# Altium project ArtixDuo.PrjPcb (part 8 of 8)
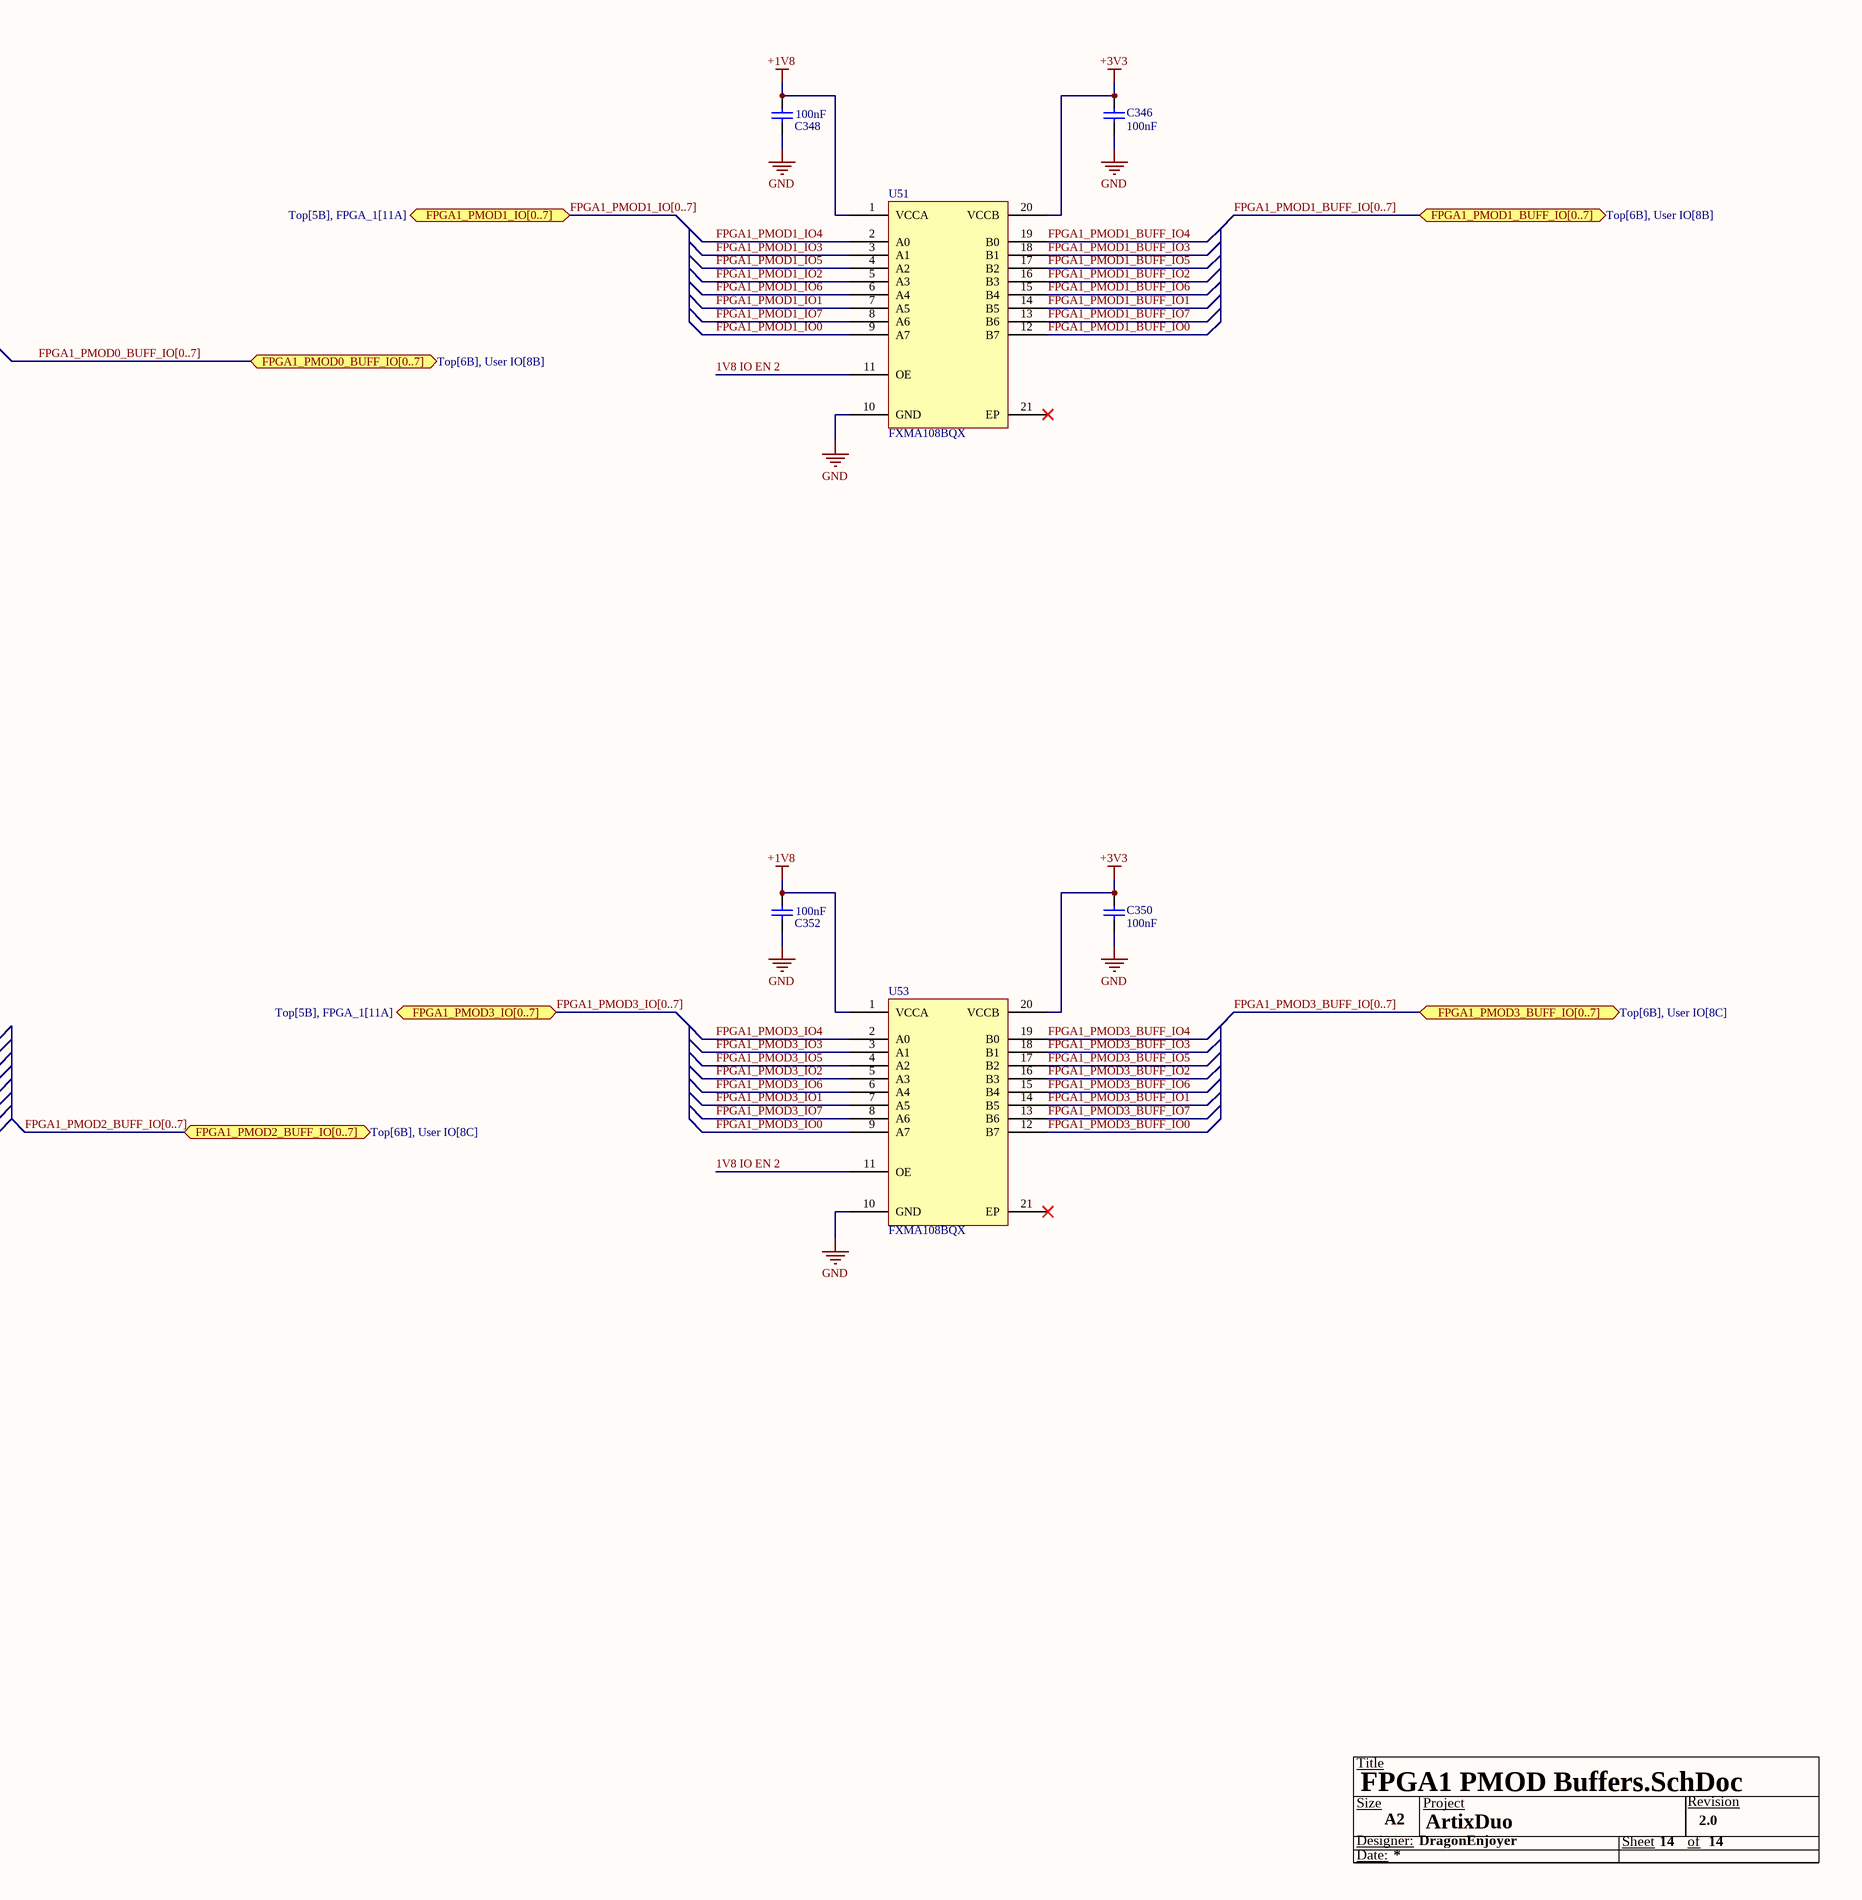
[diagram p38: FPGA1 PMOD Buffers.SchDoc, right]

## Nets that join several sheets
+1V0: FPGA_0 (51 pins), FPGA_1 (51 pins), PMU (U5.1 U5.2 U5.3 U5.12)
+1V2: FPGA_0 (16 pins), FPGA_1 (16 pins), PMU (U4.14 U4.15 U4.16)
+1V8: FPGA_0 (27 pins), FPGA_1 (27 pins), PMU (U3.1 U3.2 U3.3 U3.12), User IO Buffers (9 pins), HYPERRAM (7 pins), FPGA1 PMOD Buffers (9 pins)
+3V3: FPGA_0 (89 pins), FPGA_1 (89 pins), PMU (U1.14 U1.15 U1.16), User IO (55 pins), High Speed User IO (16 pins), User IO Buffers (57 pins), FPGA1 PMOD Buffers (8 pins)
+3V3_AUX: Aux PSU (7 pins), PMU (13 pins), RP2040 MCU (20 pins), SMC (22 pins), USB JTAG (38 pins)
GND: Aux PSU (7 pins), FPGA_0 (198 pins), FPGA_1 (198 pins), PMU (48 pins), RP2040 MCU (31 pins), SMC (35 pins), USB JTAG (76 pins), User IO (198 pins), High Speed User IO (40 pins), User IO Buffers (54 pins), HYPERRAM (7 pins), FPGA1 PMOD Buffers (15 pins)
USB_5V0_AUX_IN: Aux PSU (5 pins), PMU (19 pins), RP2040 MCU (D6.3 TP121.1), SMC (D1.3 TP12.1), USB JTAG (D4.3 TP119.1), User IO (15 pins), User IO Buffers (R275.2 R276.2 R277.1 R278.1), FPGA1 PMOD Buffers (R110.2 R111.1)
DP_RX_AUX_N: FPGA_1 (U9.P1), High Speed User IO (C303.1 U33.2)
DP_RX_AUX_P: FPGA_1 (U9.R1), High Speed User IO (C300.1 U33.1)
DP_RX_HPD: FPGA_1 (U9.J6), High Speed User IO (R267.2 U33.4)
DP_RX_L0_FPGA1_N: FPGA_1 (U9.A8), High Speed User IO (J27.12 U32.12)
DP_RX_L0_FPGA1_P: FPGA_1 (U9.B8), High Speed User IO (J27.10 U32.10)
DP_RX_L1_FPGA1_N: FPGA_1 (U9.C11), High Speed User IO (J27.9 U32.9)
DP_RX_L1_FPGA1_P: FPGA_1 (U9.D11), High Speed User IO (J27.7 U32.7)
DP_RX_L2_FPGA1_N: FPGA_1 (U9.A10), High Speed User IO (J27.6 U32.6)
DP_RX_L2_FPGA1_P: FPGA_1 (U9.B10), High Speed User IO (J27.4 U32.4)
DP_RX_L3_FPGA1_N: FPGA_1 (U9.C9), High Speed User IO (J27.3 U32.3)
DP_RX_L3_FPGA1_P: FPGA_1 (U9.D9), High Speed User IO (J27.1 U32.1)
DP_TX_AUX_N: FPGA_1 (U9.L4), High Speed User IO (C297.1 U31.2)
DP_TX_AUX_P: FPGA_1 (U9.L5), High Speed User IO (C296.1 U31.1)
DP_TX_HPD: FPGA_1 (U9.K6), High Speed User IO (R241.2 U31.4)
DP_TX_L0_FPGA1_N: FPGA_1 (U9.A4), High Speed User IO (C289.1 U30.3)
DP_TX_L0_FPGA1_P: FPGA_1 (U9.B4), High Speed User IO (C288.1 U30.1)
DP_TX_L1_FPGA1_N: FPGA_1 (U9.C5), High Speed User IO (C291.1 U30.6)
DP_TX_L1_FPGA1_P: FPGA_1 (U9.D5), High Speed User IO (C290.1 U30.4)
DP_TX_L2_FPGA1_N: FPGA_1 (U9.A6), High Speed User IO (C293.1 U30.9)
DP_TX_L2_FPGA1_P: FPGA_1 (U9.B6), High Speed User IO (C292.1 U30.7)
DP_TX_L3_FPGA1_N: FPGA_1 (U9.C7), High Speed User IO (C295.1 U30.12)
DP_TX_L3_FPGA1_P: FPGA_1 (U9.D7), High Speed User IO (C294.1 U30.10)
FPGA0_CLK_N: FPGA_0 (U14.E10), High Speed User IO (R264.1 R266.1)
FPGA0_CLK_P: FPGA_0 (U14.F10), High Speed User IO (R263.1 R264.2)
FPGA0_LED0: FPGA_0 (U14.N13), User IO (Q9.1 R205.1)
FPGA0_LED1: FPGA_0 (U14.N14), User IO (Q10.1 R206.1)
FPGA0_LED2: FPGA_0 (U14.P14), User IO (Q11.1 R207.1)
FPGA0_LED3: FPGA_0 (U14.N15), User IO (Q12.1 R208.1)
FPGA0_LED4: FPGA_0 (U14.R16), User IO (Q17.1 R221.1)
FPGA0_LED5: FPGA_0 (U14.P17), User IO (Q18.1 R222.1)
FPGA0_LED6: FPGA_0 (U14.P15), User IO (Q19.1 R223.1)
FPGA0_LED7: FPGA_0 (U14.P16), User IO (Q20.1 R224.1)
FPGA0_PMOD0_IO0: User IO (J6.5), User IO Buffers (U46.13)
FPGA0_PMOD0_IO1: User IO (J6.7), User IO Buffers (U46.15)
FPGA0_PMOD0_IO2: User IO (J6.9), User IO Buffers (U46.17)
FPGA0_PMOD0_IO3: User IO (J6.11), User IO Buffers (U46.19)
FPGA0_PMOD0_IO4: User IO (J6.12), User IO Buffers (U46.18)
FPGA0_PMOD0_IO5: User IO (J6.10), User IO Buffers (U46.16)
FPGA0_PMOD0_IO6: User IO (J6.8), User IO Buffers (U46.14)
FPGA0_PMOD0_IO7: User IO (J6.6), User IO Buffers (U46.12)
FPGA0_PMOD1_IO0: User IO (J10.5), User IO Buffers (U47.13)
FPGA0_PMOD1_IO1: User IO (J10.7), User IO Buffers (U47.15)
FPGA0_PMOD1_IO2: User IO (J10.9), User IO Buffers (U47.17)
FPGA0_PMOD1_IO3: User IO (J10.11), User IO Buffers (U47.19)
FPGA0_PMOD1_IO4: User IO (J10.12), User IO Buffers (U47.18)
FPGA0_PMOD1_IO5: User IO (J10.10), User IO Buffers (U47.16)
FPGA0_PMOD1_IO6: User IO (J10.8), User IO Buffers (U47.14)
FPGA0_PMOD1_IO7: User IO (J10.6), User IO Buffers (U47.12)
FPGA0_PMOD2_IO0: User IO (J11.5), User IO Buffers (U48.13)
FPGA0_PMOD2_IO1: User IO (J11.7), User IO Buffers (U48.15)
FPGA0_PMOD2_IO2: User IO (J11.9), User IO Buffers (U48.17)
FPGA0_PMOD2_IO3: User IO (J11.11), User IO Buffers (U48.19)
FPGA0_PMOD2_IO4: User IO (J11.12), User IO Buffers (U48.18)
FPGA0_PMOD2_IO5: User IO (J11.10), User IO Buffers (U48.16)
FPGA0_PMOD2_IO6: User IO (J11.8), User IO Buffers (U48.14)
FPGA0_PMOD2_IO7: User IO (J11.6), User IO Buffers (U48.12)
FPGA0_PMOD3_IO0: User IO (J12.5), User IO Buffers (U49.13)
FPGA0_PMOD3_IO1: User IO (J12.7), User IO Buffers (U49.15)
FPGA0_PMOD3_IO2: User IO (J12.9), User IO Buffers (U49.17)
FPGA0_PMOD3_IO3: User IO (J12.11), User IO Buffers (U49.19)
FPGA0_PMOD3_IO4: User IO (J12.12), User IO Buffers (U49.18)
FPGA0_PMOD3_IO5: User IO (J12.10), User IO Buffers (U49.16)
FPGA0_PMOD3_IO6: User IO (J12.8), User IO Buffers (U49.14)
FPGA0_PMOD3_IO7: User IO (J12.6), User IO Buffers (U49.12)
FPGA0_RX0_N: FPGA_0 (U14.A8), High Speed User IO (R245.1 R249.1)
FPGA0_RX0_P: FPGA_0 (U14.B8), High Speed User IO (R243.1 R245.2)
FPGA0_RX1_N: FPGA_0 (U14.C11), High Speed User IO (R247.1 R250.1)
FPGA0_RX1_P: FPGA_0 (U14.D11), High Speed User IO (R244.1 R247.2)
FPGA0_RX2_N: FPGA_0 (U14.A10), High Speed User IO (R256.1 R261.1)
FPGA0_RX2_P: FPGA_0 (U14.B10), High Speed User IO (R254.1 R256.2)
FPGA0_RX3_N: FPGA_0 (U14.C9), High Speed User IO (R258.1 R262.1)
FPGA0_RX3_P: FPGA_0 (U14.D9), High Speed User IO (R255.1 R258.2)
FPGA0_TX0_N: FPGA_0 (U14.A4), High Speed User IO (R227.1 R231.1)
FPGA0_TX0_P: FPGA_0 (U14.B4), High Speed User IO (R225.1 R227.2)
FPGA0_TX1_N: FPGA_0 (U14.C5), High Speed User IO (R229.1 R232.1)
FPGA0_TX1_P: FPGA_0 (U14.D5), High Speed User IO (R226.1 R229.2)
FPGA0_TX2_N: FPGA_0 (U14.C7), High Speed User IO (R235.1 R239.1)
FPGA0_TX2_P: FPGA_0 (U14.D7), High Speed User IO (R233.1 R235.2)
FPGA0_TX3_N: FPGA_0 (U14.A6), High Speed User IO (R237.1 R240.1)
FPGA0_TX3_P: FPGA_0 (U14.B6), High Speed User IO (R234.1 R237.2)
FPGA1_LED0: FPGA_1 (U9.N13), User IO (Q5.1 R201.1)
FPGA1_LED1: FPGA_1 (U9.N14), User IO (Q6.1 R202.1)
FPGA1_LED2: FPGA_1 (U9.N15), User IO (Q7.1 R203.1)
FPGA1_LED3: FPGA_1 (U9.P15), User IO (Q8.1 R204.1)
FPGA1_LED4: FPGA_1 (U9.P16), User IO (Q13.1 R217.1)
FPGA1_LED5: FPGA_1 (U9.R16), User IO (Q14.1 R218.1)
FPGA1_LED6: FPGA_1 (U9.R17), User IO (Q15.1 R219.1)
FPGA1_LED7: FPGA_1 (U9.P17), User IO (Q16.1 R220.1)
FPGA1_PMOD0_BUFF_IO0: User IO (J13.5), FPGA1 PMOD Buffers (U50.12)
FPGA1_PMOD0_BUFF_IO1: User IO (J13.7), FPGA1 PMOD Buffers (U50.14)
FPGA1_PMOD0_BUFF_IO2: User IO (J13.9), FPGA1 PMOD Buffers (U50.16)
FPGA1_PMOD0_BUFF_IO3: User IO (J13.11), FPGA1 PMOD Buffers (U50.18)
FPGA1_PMOD0_BUFF_IO4: User IO (J13.12), FPGA1 PMOD Buffers (U50.19)
FPGA1_PMOD0_BUFF_IO5: User IO (J13.10), FPGA1 PMOD Buffers (U50.17)
FPGA1_PMOD0_BUFF_IO6: User IO (J13.8), FPGA1 PMOD Buffers (U50.15)
FPGA1_PMOD0_BUFF_IO7: User IO (J13.6), FPGA1 PMOD Buffers (U50.13)
FPGA1_PMOD0_IO0: FPGA_1 (U9.A1), FPGA1 PMOD Buffers (U50.9)
FPGA1_PMOD0_IO1: FPGA_1 (U9.B2), FPGA1 PMOD Buffers (U50.7)
FPGA1_PMOD0_IO2: FPGA_1 (U9.D1), FPGA1 PMOD Buffers (U50.5)
FPGA1_PMOD0_IO3: FPGA_1 (U9.E1), FPGA1 PMOD Buffers (U50.3)
FPGA1_PMOD0_IO4: FPGA_1 (U9.E2), FPGA1 PMOD Buffers (U50.2)
FPGA1_PMOD0_IO5: FPGA_1 (U9.D2), FPGA1 PMOD Buffers (U50.4)
FPGA1_PMOD0_IO6: FPGA_1 (U9.C2), FPGA1 PMOD Buffers (U50.6)
FPGA1_PMOD0_IO7: FPGA_1 (U9.B1), FPGA1 PMOD Buffers (U50.8)
FPGA1_PMOD1_BUFF_IO0: User IO (J14.5), FPGA1 PMOD Buffers (U51.12)
FPGA1_PMOD1_BUFF_IO1: User IO (J14.7), FPGA1 PMOD Buffers (U51.14)
FPGA1_PMOD1_BUFF_IO2: User IO (J14.9), FPGA1 PMOD Buffers (U51.16)
FPGA1_PMOD1_BUFF_IO3: User IO (J14.11), FPGA1 PMOD Buffers (U51.18)
FPGA1_PMOD1_BUFF_IO4: User IO (J14.12), FPGA1 PMOD Buffers (U51.19)
FPGA1_PMOD1_BUFF_IO5: User IO (J14.10), FPGA1 PMOD Buffers (U51.17)
FPGA1_PMOD1_BUFF_IO6: User IO (J14.8), FPGA1 PMOD Buffers (U51.15)
FPGA1_PMOD1_BUFF_IO7: User IO (J14.6), FPGA1 PMOD Buffers (U51.13)
FPGA1_PMOD1_IO0: FPGA_1 (U9.F1), FPGA1 PMOD Buffers (U51.9)
FPGA1_PMOD1_IO1: FPGA_1 (U9.G1), FPGA1 PMOD Buffers (U51.7)
FPGA1_PMOD1_IO2: FPGA_1 (U9.G2), FPGA1 PMOD Buffers (U51.5)
FPGA1_PMOD1_IO3: FPGA_1 (U9.J1), FPGA1 PMOD Buffers (U51.3)
FPGA1_PMOD1_IO4: FPGA_1 (U9.K1), FPGA1 PMOD Buffers (U51.2)
FPGA1_PMOD1_IO5: FPGA_1 (U9.H2), FPGA1 PMOD Buffers (U51.4)
FPGA1_PMOD1_IO6: FPGA_1 (U9.F3), FPGA1 PMOD Buffers (U51.6)
FPGA1_PMOD1_IO7: FPGA_1 (U9.E3), FPGA1 PMOD Buffers (U51.8)
FPGA1_PMOD2_BUFF_IO0: User IO (J15.5), FPGA1 PMOD Buffers (U52.12)
FPGA1_PMOD2_BUFF_IO1: User IO (J15.7), FPGA1 PMOD Buffers (U52.14)
FPGA1_PMOD2_BUFF_IO2: User IO (J15.9), FPGA1 PMOD Buffers (U52.16)
FPGA1_PMOD2_BUFF_IO3: User IO (J15.11), FPGA1 PMOD Buffers (U52.18)
FPGA1_PMOD2_BUFF_IO4: User IO (J15.12), FPGA1 PMOD Buffers (U52.19)
FPGA1_PMOD2_BUFF_IO5: User IO (J15.10), FPGA1 PMOD Buffers (U52.17)
FPGA1_PMOD2_BUFF_IO6: User IO (J15.8), FPGA1 PMOD Buffers (U52.15)
FPGA1_PMOD2_BUFF_IO7: User IO (J15.6), FPGA1 PMOD Buffers (U52.13)
FPGA1_PMOD2_IO0: FPGA_1 (U9.G3), FPGA1 PMOD Buffers (U52.9)
FPGA1_PMOD2_IO1: FPGA_1 (U9.J2), FPGA1 PMOD Buffers (U52.7)
FPGA1_PMOD2_IO2: FPGA_1 (U9.G4), FPGA1 PMOD Buffers (U52.5)
FPGA1_PMOD2_IO3: FPGA_1 (U9.H4), FPGA1 PMOD Buffers (U52.3)
FPGA1_PMOD2_IO4: FPGA_1 (U9.H5), FPGA1 PMOD Buffers (U52.2)
FPGA1_PMOD2_IO5: FPGA_1 (U9.J5), FPGA1 PMOD Buffers (U52.4)
FPGA1_PMOD2_IO6: FPGA_1 (U9.H3), FPGA1 PMOD Buffers (U52.6)
FPGA1_PMOD2_IO7: FPGA_1 (U9.K2), FPGA1 PMOD Buffers (U52.8)
FPGA1_PMOD3_BUFF_IO0: User IO (J16.5), FPGA1 PMOD Buffers (U53.12)
FPGA1_PMOD3_BUFF_IO1: User IO (J16.7), FPGA1 PMOD Buffers (U53.14)
FPGA1_PMOD3_BUFF_IO2: User IO (J16.9), FPGA1 PMOD Buffers (U53.16)
FPGA1_PMOD3_BUFF_IO3: User IO (J16.11), FPGA1 PMOD Buffers (U53.18)
FPGA1_PMOD3_BUFF_IO4: User IO (J16.12), FPGA1 PMOD Buffers (U53.19)
FPGA1_PMOD3_BUFF_IO5: User IO (J16.10), FPGA1 PMOD Buffers (U53.17)
FPGA1_PMOD3_BUFF_IO6: User IO (J16.8), FPGA1 PMOD Buffers (U53.15)
FPGA1_PMOD3_BUFF_IO7: User IO (J16.6), FPGA1 PMOD Buffers (U53.13)
FPGA1_PMOD3_IO0: FPGA_1 (U9.J4), FPGA1 PMOD Buffers (U53.9)
FPGA1_PMOD3_IO1: FPGA_1 (U9.L1), FPGA1 PMOD Buffers (U53.7)
FPGA1_PMOD3_IO2: FPGA_1 (U9.M1), FPGA1 PMOD Buffers (U53.5)
FPGA1_PMOD3_IO3: FPGA_1 (U9.M3), FPGA1 PMOD Buffers (U53.3)
FPGA1_PMOD3_IO4: FPGA_1 (U9.K4), FPGA1 PMOD Buffers (U53.2)
FPGA1_PMOD3_IO5: FPGA_1 (U9.M2), FPGA1 PMOD Buffers (U53.4)
FPGA1_PMOD3_IO6: FPGA_1 (U9.L3), FPGA1 PMOD Buffers (U53.6)
FPGA1_PMOD3_IO7: FPGA_1 (U9.K3), FPGA1 PMOD Buffers (U53.8)
FPGA_LINK_BUS_IO0: FPGA_0 (U14.L14), FPGA_1 (TP16.1 U9.J15)
FPGA_LINK_BUS_IO1: FPGA_0 (U14.J15), FPGA_1 (TP17.1 U9.L14)
FPGA_LINK_BUS_IO2: FPGA_0 (U14.M13), FPGA_1 (TP18.1 U9.L15)
FPGA_LINK_BUS_IO3: FPGA_0 (U14.M15), FPGA_1 (TP19.1 U9.K14)
FPGA_LINK_BUS_IO4: FPGA_0 (U14.L15), FPGA_1 (TP20.1 U9.M13)
FPGA_LINK_BUS_IO5: FPGA_0 (U14.L13), FPGA_1 (TP21.1 U9.M15)
FPGA_LINK_BUS_IO6: FPGA_0 (U14.K14), FPGA_1 (TP22.1 U9.L16)
FPGA_LINK_BUS_IO7: FPGA_0 (U14.K16), FPGA_1 (TP23.1 U9.K13)
FPGA_LINK_BUS_IO8: FPGA_0 (U14.L16), FPGA_1 (TP24.1 U9.L13)
FPGA_LINK_BUS_IO9: FPGA_0 (U14.J14), FPGA_1 (TP25.1 U9.M17)
FPGA_LINK_BUS_IO10: FPGA_0 (U14.H15), FPGA_1 (TP26.1 U9.M16)
FPGA_LINK_BUS_IO11: FPGA_0 (U14.J16), FPGA_1 (TP27.1 U9.N19)
FPGA_LINK_BUS_IO12: FPGA_0 (U14.G17), FPGA_1 (TP28.1 U9.L19)
FPGA_LINK_BUS_IO13: FPGA_0 (U14.H20), FPGA_1 (TP29.1 U9.K19)
FPGA_LINK_BUS_IO14: FPGA_0 (U14.K22), FPGA_1 (TP30.1 U9.J21)
FPGA_LINK_BUS_IO15: FPGA_0 (U14.M21), FPGA_1 (TP31.1 U9.G20)
FPGA_LINK_BUS_IO16: FPGA_0 (U14.N20), FPGA_1 (TP32.1 U9.H17)
FPGA_LINK_BUS_IO17: FPGA_0 (U14.M18), FPGA_1 (TP33.1 U9.H13)
FPGA_LINK_BUS_IO18: FPGA_0 (U14.L18), FPGA_1 (TP34.1 U9.G13)
FPGA_LINK_BUS_IO19: FPGA_0 (U14.N22), FPGA_1 (TP35.1 U9.H18)
FPGA_LINK_BUS_IO20: FPGA_0 (U14.L21), FPGA_1 (TP36.1 U9.J17)
FPGA_LINK_BUS_IO21: FPGA_0 (U14.J22), FPGA_1 (TP37.1 U9.J19)
FPGA_LINK_BUS_IO22: FPGA_0 (U14.J20), FPGA_1 (TP38.1 U9.L20)
FPGA_LINK_BUS_IO23: FPGA_0 (U14.G18), FPGA_1 (TP39.1 U9.M20)
FPGA_LINK_BUS_IO24: FPGA_0 (U14.G15), FPGA_1 (TP40.1 U9.N18)
FPGA_LINK_BUS_IO25: FPGA_0 (U14.K13), FPGA_1 (TP41.1 U9.K16)
FPGA_LINK_BUS_IO26: FPGA_0 (U14.H13), FPGA_1 (TP42.1 U9.K17)
FPGA_LINK_BUS_IO27: FPGA_0 (U14.H14), FPGA_1 (TP43.1 U9.M18)
FPGA_LINK_BUS_IO28: FPGA_0 (U14.G16), FPGA_1 (TP44.1 U9.N20)
FPGA_LINK_BUS_IO29: FPGA_0 (U14.H19), FPGA_1 (TP45.1 U9.M21)
FPGA_LINK_BUS_IO30: FPGA_0 (U14.H22), FPGA_1 (TP46.1 U9.K22)
FPGA_LINK_BUS_IO31: FPGA_0 (U14.K19), FPGA_1 (TP47.1 U9.J20)
FPGA_LINK_BUS_IO32: FPGA_0 (U14.L19), FPGA_1 (TP48.1 U9.G18)
FPGA_LINK_BUS_IO33: FPGA_0 (U14.N19), FPGA_1 (TP49.1 U9.G15)
FPGA_LINK_BUS_IO34: FPGA_0 (U14.M16), FPGA_1 (TP50.1 U9.J14)
FPGA_LINK_BUS_IO35: FPGA_0 (U14.M17), FPGA_1 (TP51.1 U9.H15)
FPGA_LINK_BUS_IO36: FPGA_0 (U14.K17), FPGA_1 (TP52.1 U9.H14)
FPGA_LINK_BUS_IO37: FPGA_0 (U14.K18), FPGA_1 (TP53.1 U9.G16)
FPGA_LINK_BUS_IO38: FPGA_0 (U14.N18), FPGA_1 (TP54.1 U9.J16)
FPGA_LINK_BUS_IO39: FPGA_0 (U14.M20), FPGA_1 (TP55.1 U9.G17)
FPGA_LINK_BUS_IO40: FPGA_0 (U14.M22), FPGA_1 (TP56.1 U9.H19)
FPGA_LINK_BUS_IO41: FPGA_0 (U14.L20), FPGA_1 (TP57.1 U9.H20)
FPGA_LINK_BUS_IO42: FPGA_0 (U14.K21), FPGA_1 (TP58.1 U9.H22)
FPGA_LINK_BUS_IO43: FPGA_0 (U14.J19), FPGA_1 (TP59.1 U9.J22)
FPGA_LINK_BUS_IO44: FPGA_0 (U14.J21), FPGA_1 (TP60.1 U9.K21)
FPGA_LINK_BUS_IO45: FPGA_0 (U14.J17), FPGA_1 (TP61.1 U9.L21)
FPGA_LINK_BUS_IO46: FPGA_0 (U14.G20), FPGA_1 (TP62.1 U9.M22)
FPGA_LINK_BUS_IO47: FPGA_0 (U14.H18), FPGA_1 (TP63.1 U9.N22)
FPGA_LINK_BUS_IO48: FPGA_0 (U14.H17), FPGA_1 (TP64.1 U9.K18)
FPGA_LINK_BUS_IO49: FPGA_0 (U14.G13), FPGA_1 (TP65.1 U9.L18)
FPGA_LINK_BUS_IO50: FPGA_0 (U14.F13), FPGA_1 (TP66.1 U9.D14)
FPGA_LINK_BUS_IO51: FPGA_0 (U14.E13), FPGA_1 (TP67.1 U9.D15)
FPGA_LINK_BUS_IO52: FPGA_0 (U14.E14), FPGA_1 (TP68.1 U9.C13)
FPGA_LINK_BUS_IO53: FPGA_0 (U14.F18), FPGA_1 (TP69.1 U9.A14)
FPGA_LINK_BUS_IO54: FPGA_0 (U14.E16), FPGA_1 (TP70.1 U9.A13)
FPGA_LINK_BUS_IO55: FPGA_0 (U14.F15), FPGA_1 (TP71.1 U9.B13)
FPGA_LINK_BUS_IO56: FPGA_0 (U14.F14), FPGA_1 (TP72.1 U9.C14)
FPGA_LINK_BUS_IO57: FPGA_0 (U14.F16), FPGA_1 (TP73.1 U9.C15)
FPGA_LINK_BUS_IO58: FPGA_0 (U14.E17), FPGA_1 (TP74.1 U9.B15)
FPGA_LINK_BUS_IO59: FPGA_0 (U14.E18), FPGA_1 (TP75.1 U9.D16)
FPGA_LINK_BUS_IO60: FPGA_0 (U14.G21), FPGA_1 (TP76.1 U9.B16)
FPGA_LINK_BUS_IO61: FPGA_0 (U14.F20), FPGA_1 (TP77.1 U9.D17)
FPGA_LINK_BUS_IO62: FPGA_0 (U14.D19), FPGA_1 (TP78.1 U9.A19)
FPGA_LINK_BUS_IO63: FPGA_0 (U14.E21), FPGA_1 (TP79.1 U9.A18)
FPGA_LINK_BUS_IO64: FPGA_0 (U14.F21), FPGA_1 (TP80.1 U9.B17)
FPGA_LINK_BUS_IO65: FPGA_0 (U14.G22), FPGA_1 (TP81.1 U9.A16)
FPGA_LINK_BUS_IO66: FPGA_0 (U14.F19), FPGA_1 (TP82.1 U9.A15)
FPGA_LINK_BUS_IO67: FPGA_0 (U14.E19), FPGA_1 (TP83.1 U9.C17)
FPGA_LINK_BUS_IO68: FPGA_0 (U14.E22), FPGA_1 (TP84.1 U9.B18)
FPGA_LINK_BUS_IO69: FPGA_0 (U14.D22), FPGA_1 (TP85.1 U9.C18)
FPGA_LINK_BUS_IO70: FPGA_0 (U14.C22), FPGA_1 (TP86.1 U9.C19)
FPGA_LINK_BUS_IO71: FPGA_0 (U14.B22), FPGA_1 (TP87.1 U9.C20)
FPGA_LINK_BUS_IO72: FPGA_0 (U14.C19), FPGA_1 (TP88.1 U9.D22)
FPGA_LINK_BUS_IO73: FPGA_0 (U14.B20), FPGA_1 (TP89.1 U9.D20)
FPGA_LINK_BUS_IO74: FPGA_0 (U14.C20), FPGA_1 (TP90.1 U9.B21)
FPGA_LINK_BUS_IO75: FPGA_0 (U14.D20), FPGA_1 (TP91.1 U9.A21)
FPGA_LINK_BUS_IO76: FPGA_0 (U14.D21), FPGA_1 (TP92.1 U9.A20)
FPGA_LINK_BUS_IO77: FPGA_0 (U14.B21), FPGA_1 (TP93.1 U9.B20)
FPGA_LINK_BUS_IO78: FPGA_0 (U14.A21), FPGA_1 (TP94.1 U9.B22)
FPGA_LINK_BUS_IO79: FPGA_0 (U14.A20), FPGA_1 (TP95.1 U9.D21)
FPGA_LINK_BUS_IO80: FPGA_0 (U14.A19), FPGA_1 (TP96.1 U9.E22)
FPGA_LINK_BUS_IO81: FPGA_0 (U14.A18), FPGA_1 (TP97.1 U9.F21)
FPGA_LINK_BUS_IO82: FPGA_0 (U14.B16), FPGA_1 (TP98.1 U9.E18)
FPGA_LINK_BUS_IO83: FPGA_0 (U14.D17), FPGA_1 (TP99.1 U9.G22)
FPGA_LINK_BUS_IO84: FPGA_0 (U14.C17), FPGA_1 (TP100.1 U9.E19)
FPGA_LINK_BUS_IO85: FPGA_0 (U14.B18), FPGA_1 (TP101.1 U9.D19)
FPGA_LINK_BUS_IO86: FPGA_0 (U14.C18), FPGA_1 (TP102.1 U9.C22)
FPGA_LINK_BUS_IO87: FPGA_0 (U14.B17), FPGA_1 (TP103.1 U9.E21)
FPGA_LINK_BUS_IO88: FPGA_0 (U14.A16), FPGA_1 (TP104.1 U9.F20)
FPGA_LINK_BUS_IO89: FPGA_0 (U14.A15), FPGA_1 (TP105.1 U9.F19)
FPGA_LINK_BUS_IO90: FPGA_0 (U14.A14), FPGA_1 (TP106.1 U9.E17)
FPGA_LINK_BUS_IO91: FPGA_0 (U14.A13), FPGA_1 (TP107.1 U9.F15)
FPGA_LINK_BUS_IO92: FPGA_0 (U14.C13), FPGA_1 (TP108.1 U9.F14)
FPGA_LINK_BUS_IO93: FPGA_0 (U14.C15), FPGA_1 (TP109.1 U9.F16)
FPGA_LINK_BUS_IO94: FPGA_0 (U14.B15), FPGA_1 (TP110.1 U9.F18)
FPGA_LINK_BUS_IO95: FPGA_0 (U14.D16), FPGA_1 (TP111.1 U9.G21)
FPGA_LINK_BUS_IO96: FPGA_0 (U14.B13), FPGA_1 (TP112.1 U9.E16)
FPGA_LINK_BUS_IO97: FPGA_0 (U14.C14), FPGA_1 (TP113.1 U9.E14)
FPGA_LINK_BUS_IO98: FPGA_0 (U14.D15), FPGA_1 (TP114.1 U9.E13)
FPGA_LINK_BUS_IO99: FPGA_0 (U14.D14), FPGA_1 (TP115.1 U9.F13)
HYPERRAM_FPGA0_CLK_N: FPGA_0 (U14.G4), HYPERRAM (U29.B1)
HYPERRAM_FPGA0_CLK_P: FPGA_0 (U14.H4), HYPERRAM (U29.B2)
HYPERRAM_FPGA0_CS: FPGA_0 (U14.B1), HYPERRAM (U29.A3)
HYPERRAM_FPGA0_DQ0: FPGA_0 (U14.E1), HYPERRAM (U29.D3)
HYPERRAM_FPGA0_DQ1: FPGA_0 (U14.F3), HYPERRAM (U29.D2)
HYPERRAM_FPGA0_DQ2: FPGA_0 (U14.E3), HYPERRAM (U29.C4)
HYPERRAM_FPGA0_DQ3: FPGA_0 (U14.D1), HYPERRAM (U29.D4)
HYPERRAM_FPGA0_DQ4: FPGA_0 (U14.D2), HYPERRAM (U29.D5)
HYPERRAM_FPGA0_DQ5: FPGA_0 (U14.E2), HYPERRAM (U29.E3)
HYPERRAM_FPGA0_DQ6: FPGA_0 (U14.F1), HYPERRAM (U29.E2)
HYPERRAM_FPGA0_DQ7: FPGA_0 (U14.G1), HYPERRAM (U29.E1)
HYPERRAM_FPGA0_RST: FPGA_0 (U14.A1), HYPERRAM (U29.A4)
HYPERRAM_FPGA0_RWDS: FPGA_0 (U14.C2), HYPERRAM (U29.C3)
JTAG_TCK_FPGA0: FPGA_0 (U14.V12), USB JTAG (TP132.1 U21.9)
JTAG_TCK_FPGA1: FPGA_1 (U9.V12), USB JTAG (TP138.1 U24.9)
JTAG_TDI_FPGA0: FPGA_0 (U14.R13), USB JTAG (TP133.1 U21.7)
JTAG_TDI_FPGA1: FPGA_1 (U9.R13), USB JTAG (TP140.1 U24.7)
JTAG_TDO_FPGA0: FPGA_0 (U14.U13), USB JTAG (P3.8 R80.1 TP135.1 U22.18)
JTAG_TDO_FPGA1: FPGA_1 (U9.U13), USB JTAG (P2.8 R76.1 TP136.1 U22.28)
JTAG_TMS_FPGA0: FPGA_0 (U14.T13), USB JTAG (TP134.1 U21.4)
JTAG_TMS_FPGA1: FPGA_1 (U9.T13), USB JTAG (TP143.1 U24.4)
MCU_FPGA0_IO0: FPGA_0 (U14.U20), RP2040 MCU (U27.27)
MCU_FPGA0_IO1: FPGA_0 (U14.V20), RP2040 MCU (U27.28)
MCU_FPGA0_IO2: FPGA_0 (U14.W22), RP2040 MCU (U27.29)
MCU_FPGA0_IO3: FPGA_0 (U14.Y22), RP2040 MCU (U27.30)
MCU_FPGA0_IO4: FPGA_0 (U14.Y21), RP2040 MCU (U27.31)
MCU_FPGA0_IO5: FPGA_0 (U14.AA21), RP2040 MCU (U27.32)
MCU_FPGA0_IO6: FPGA_0 (U14.AB22), RP2040 MCU (U27.34)
MCU_FPGA0_IO7: FPGA_0 (U14.AB21), RP2040 MCU (U27.35)
MCU_FPGA0_IO8: FPGA_0 (U14.AA20), RP2040 MCU (U27.36)
MCU_FPGA1_IO0: FPGA_1 (U9.AB21), RP2040 MCU (U27.9)
MCU_FPGA1_IO1: FPGA_1 (U9.AB22), RP2040 MCU (U27.11)
MCU_FPGA1_IO2: FPGA_1 (U9.U20), RP2040 MCU (U27.12)
MCU_FPGA1_IO3: FPGA_1 (U9.V20), RP2040 MCU (U27.13)
MCU_FPGA1_IO4: FPGA_1 (U9.Y22), RP2040 MCU (U27.14)
MCU_FPGA1_IO5: FPGA_1 (U9.W22), RP2040 MCU (U27.15)
MCU_FPGA1_IO6: FPGA_1 (U9.Y21), RP2040 MCU (U27.16)
MCU_FPGA1_IO7: FPGA_1 (U9.AA21), RP2040 MCU (U27.17)
MCU_FPGA1_IO8: FPGA_1 (U9.AA20), RP2040 MCU (U27.18)
PMU_CH1_EN: PMU (R5.2 TP125.1 U2.31), SMC (U7.11)
PMU_CH2_EN: PMU (R6.2 TP126.1 U2.10), SMC (U7.13)
PMU_CH3_EN: PMU (R7.2 TP127.1 U2.15), SMC (U7.12)
PMU_CH4_EN: PMU (R8.2 TP128.1 U2.26), SMC (U7.9)
PMU_ISNS_SCL: PMU (7 pins), SMC (U7.7)
PMU_ISNS_SDA: PMU (7 pins), SMC (U7.6)
PMU_MODE: PMU (R15.2 R16.2 TP130.1 U2.28), SMC (U7.8)
PMU_PGOOD: PMU (R17.1 TP131.1 U2.14), SMC (U7.14)
PMU_TEMP: PMU (U2.30), SMC (U7.38)
SMC_ADC_TSNS_FPGA0: FPGA_0 (U15.2), SMC (U7.40)
SMC_ADC_TSNS_FPGA1: FPGA_1 (U10.2), SMC (U7.39)
SMC_IO_FPGA0_IO0: FPGA_0 (U14.T21), SMC (U7.35)
SMC_IO_FPGA0_IO1: FPGA_0 (U14.U21), SMC (U7.36)
SMC_IO_FPGA1_IO0: FPGA_1 (U9.T21), SMC (U7.32)
SMC_IO_FPGA1_IO1: FPGA_1 (U9.U21), SMC (U7.34)
SMC_SPI_FPGA0_CLK: FPGA_0 (U14.W19), SMC (U7.29)
SMC_SPI_FPGA0_CS: FPGA_0 (U14.AB20), SMC (U7.28)
SMC_SPI_FPGA0_RX: FPGA_0 (U14.AA19), SMC (U7.27)
SMC_SPI_FPGA0_TX: FPGA_0 (U14.V19), SMC (U7.30)
SMC_SPI_FPGA1_CLK: FPGA_1 (U9.W19), SMC (U7.17)
SMC_SPI_FPGA1_CS: FPGA_1 (U9.AA19), SMC (U7.16)
SMC_SPI_FPGA1_RX: FPGA_1 (U9.AB20), SMC (U7.15)
SMC_SPI_FPGA1_TX: FPGA_1 (U9.V19), SMC (U7.18)
UART_RX_FPGA0: FPGA_0 (U14.R21), USB JTAG (TP139.1 U22.39)
UART_RX_FPGA1: FPGA_1 (U9.R21), USB JTAG (TP142.1 U22.52)
UART_TX_FPGA0: FPGA_0 (U14.P21), USB JTAG (TP137.1 U22.38)
UART_TX_FPGA1: FPGA_1 (U9.P21), USB JTAG (TP141.1 U22.48)
USER_FPGA0_BUTTON0: FPGA_0 (U14.R17), User IO (R161.1)
USER_FPGA0_BUTTON1: FPGA_0 (U14.U17), User IO (R169.1)
USER_FPGA0_BUTTON2: FPGA_0 (U14.U18), User IO (R175.1)
USER_FPGA0_BUTTON3: FPGA_0 (U14.AB18), User IO (R183.1)
USER_FPGA1_BUTTON0: FPGA_1 (U9.P14), User IO (R162.1)
USER_FPGA1_BUTTON1: FPGA_1 (U9.U17), User IO (R170.1)
USER_FPGA1_BUTTON2: FPGA_1 (U9.U18), User IO (R176.1)
USER_FPGA1_BUTTON3: FPGA_1 (U9.AB18), User IO (R184.1)
USER_IO_FPGA0_IO0: FPGA_0 (U14.V5), User IO Buffers (U35.2)
USER_IO_FPGA0_IO1: FPGA_0 (U14.U6), User IO Buffers (U35.3)
USER_IO_FPGA0_IO2: FPGA_0 (U14.V7), User IO Buffers (U35.4)
USER_IO_FPGA0_IO3: FPGA_0 (U14.V9), User IO Buffers (U35.5)
USER_IO_FPGA0_IO4: FPGA_0 (U14.V8), User IO Buffers (U35.6)
USER_IO_FPGA0_IO5: FPGA_0 (U14.W9), User IO Buffers (U35.7)
USER_IO_FPGA0_IO6: FPGA_0 (U14.W6), User IO Buffers (U35.8)
USER_IO_FPGA0_IO7: FPGA_0 (U14.Y9), User IO Buffers (U35.9)
USER_IO_FPGA0_IO8: FPGA_0 (U14.W7), User IO Buffers (U37.2)
USER_IO_FPGA0_IO9: FPGA_0 (U14.Y8), User IO Buffers (U37.3)
USER_IO_FPGA0_IO10: FPGA_0 (U14.Y7), User IO Buffers (U37.4)
USER_IO_FPGA0_IO11: FPGA_0 (U14.AA8), User IO Buffers (U37.5)
USER_IO_FPGA0_IO12: FPGA_0 (U14.AB8), User IO Buffers (U37.6)
USER_IO_FPGA0_IO13: FPGA_0 (U14.Y6), User IO Buffers (U37.7)
USER_IO_FPGA0_IO14: FPGA_0 (U14.AB7), User IO Buffers (U37.8)
USER_IO_FPGA0_IO15: FPGA_0 (U14.AA6), User IO Buffers (U37.9)
USER_IO_FPGA0_IO16: FPGA_0 (U14.AB6), User IO Buffers (U36.2)
USER_IO_FPGA0_IO17: FPGA_0 (U14.W5), User IO Buffers (U36.3)
USER_IO_FPGA0_IO18: FPGA_0 (U14.AB5), User IO Buffers (U36.4)
USER_IO_FPGA0_IO19: FPGA_0 (U14.AA5), User IO Buffers (U36.5)
USER_IO_FPGA0_IO20: FPGA_0 (U14.Y4), User IO Buffers (U36.6)
USER_IO_FPGA0_IO21: FPGA_0 (U14.AA4), User IO Buffers (U36.7)
USER_IO_FPGA0_IO22: FPGA_0 (U14.W4), User IO Buffers (U36.8)
USER_IO_FPGA0_IO23: FPGA_0 (U14.AB3), User IO Buffers (U36.9)
USER_IO_FPGA0_IO24: FPGA_0 (U14.AA3), User IO Buffers (U34.2)
USER_IO_FPGA0_IO25: FPGA_0 (U14.AB2), User IO Buffers (U34.3)
USER_IO_FPGA0_IO26: FPGA_0 (U14.Y3), User IO Buffers (U34.4)
USER_IO_FPGA0_IO27: FPGA_0 (U14.AB1), User IO Buffers (U34.5)
USER_IO_FPGA0_IO28: FPGA_0 (U14.Y2), User IO Buffers (U34.6)
USER_IO_FPGA0_IO29: FPGA_0 (U14.AA1), User IO Buffers (U34.7)
USER_IO_FPGA0_IO30: FPGA_0 (U14.V4), User IO Buffers (U34.8)
USER_IO_FPGA0_IO31: FPGA_0 (U14.Y1), User IO Buffers (U34.9)
USER_IO_FPGA0_IO32: FPGA_0 (U14.W2), User IO Buffers (U38.2)
USER_IO_FPGA0_IO33: FPGA_0 (U14.W1), User IO Buffers (U38.3)
USER_IO_FPGA0_IO34: FPGA_0 (U14.V3), User IO Buffers (U38.4)
USER_IO_FPGA0_IO35: FPGA_0 (U14.V2), User IO Buffers (U38.5)
USER_IO_FPGA0_IO36: FPGA_0 (U14.U3), User IO Buffers (U38.6)
USER_IO_FPGA0_IO37: FPGA_0 (U14.U2), User IO Buffers (U38.7)
USER_IO_FPGA0_IO38: FPGA_0 (U14.U1), User IO Buffers (U38.8)
USER_IO_FPGA0_IO39: FPGA_0 (U14.U5), User IO Buffers (U38.9)
USER_IO_FPGA0_IO40: FPGA_0 (U14.R6), User IO Buffers (U39.2)
USER_IO_FPGA0_IO41: FPGA_0 (U14.T6), User IO Buffers (U39.3)
USER_IO_FPGA0_IO42: FPGA_0 (U14.T5), User IO Buffers (U39.4)
USER_IO_FPGA0_IO43: FPGA_0 (U14.R4), User IO Buffers (U39.5)
USER_IO_FPGA0_IO44: FPGA_0 (U14.R3), User IO Buffers (U39.6)
USER_IO_FPGA0_IO45: FPGA_0 (U14.R2), User IO Buffers (U39.7)
USER_IO_FPGA0_IO46: FPGA_0 (U14.T4), User IO Buffers (U39.8)
USER_IO_FPGA0_IO47: FPGA_0 (U14.T1), User IO Buffers (U39.9)
USER_IO_FPGA1_IO0: FPGA_1 (U9.V5), User IO Buffers (U40.2)
USER_IO_FPGA1_IO1: FPGA_1 (U9.U6), User IO Buffers (U40.3)
USER_IO_FPGA1_IO2: FPGA_1 (U9.V7), User IO Buffers (U40.4)
USER_IO_FPGA1_IO3: FPGA_1 (U9.V9), User IO Buffers (U40.5)
USER_IO_FPGA1_IO4: FPGA_1 (U9.V8), User IO Buffers (U40.6)
USER_IO_FPGA1_IO5: FPGA_1 (U9.W9), User IO Buffers (U40.7)
USER_IO_FPGA1_IO6: FPGA_1 (U9.W6), User IO Buffers (U40.8)
USER_IO_FPGA1_IO7: FPGA_1 (U9.Y9), User IO Buffers (U40.9)
USER_IO_FPGA1_IO8: FPGA_1 (U9.W7), User IO Buffers (U41.2)
USER_IO_FPGA1_IO9: FPGA_1 (U9.Y8), User IO Buffers (U41.3)
USER_IO_FPGA1_IO10: FPGA_1 (U9.Y7), User IO Buffers (U41.4)
USER_IO_FPGA1_IO11: FPGA_1 (U9.AA8), User IO Buffers (U41.5)
USER_IO_FPGA1_IO12: FPGA_1 (U9.AB8), User IO Buffers (U41.6)
USER_IO_FPGA1_IO13: FPGA_1 (U9.Y6), User IO Buffers (U41.7)
USER_IO_FPGA1_IO14: FPGA_1 (U9.AB7), User IO Buffers (U41.8)
USER_IO_FPGA1_IO15: FPGA_1 (U9.AA6), User IO Buffers (U41.9)
USER_IO_FPGA1_IO16: FPGA_1 (U9.AB6), User IO Buffers (U42.2)
USER_IO_FPGA1_IO17: FPGA_1 (U9.W5), User IO Buffers (U42.3)
USER_IO_FPGA1_IO18: FPGA_1 (U9.AB5), User IO Buffers (U42.4)
USER_IO_FPGA1_IO19: FPGA_1 (U9.AA5), User IO Buffers (U42.5)
USER_IO_FPGA1_IO20: FPGA_1 (U9.Y4), User IO Buffers (U42.6)
USER_IO_FPGA1_IO21: FPGA_1 (U9.AA4), User IO Buffers (U42.7)
USER_IO_FPGA1_IO22: FPGA_1 (U9.W4), User IO Buffers (U42.8)
USER_IO_FPGA1_IO23: FPGA_1 (U9.AB3), User IO Buffers (U42.9)
USER_IO_FPGA1_IO24: FPGA_1 (U9.AA3), User IO Buffers (U44.2)
USER_IO_FPGA1_IO25: FPGA_1 (U9.AB2), User IO Buffers (U44.3)
USER_IO_FPGA1_IO26: FPGA_1 (U9.Y3), User IO Buffers (U44.4)
USER_IO_FPGA1_IO27: FPGA_1 (U9.AB1), User IO Buffers (U44.5)
USER_IO_FPGA1_IO28: FPGA_1 (U9.Y2), User IO Buffers (U44.6)
USER_IO_FPGA1_IO29: FPGA_1 (U9.AA1), User IO Buffers (U44.7)
USER_IO_FPGA1_IO30: FPGA_1 (U9.V4), User IO Buffers (U44.8)
USER_IO_FPGA1_IO31: FPGA_1 (U9.Y1), User IO Buffers (U44.9)
USER_IO_FPGA1_IO32: FPGA_1 (U9.W2), User IO Buffers (U43.2)
USER_IO_FPGA1_IO33: FPGA_1 (U9.W1), User IO Buffers (U43.3)
USER_IO_FPGA1_IO34: FPGA_1 (U9.V3), User IO Buffers (U43.4)
USER_IO_FPGA1_IO35: FPGA_1 (U9.V2), User IO Buffers (U43.5)
USER_IO_FPGA1_IO36: FPGA_1 (U9.U3), User IO Buffers (U43.6)
USER_IO_FPGA1_IO37: FPGA_1 (U9.U2), User IO Buffers (U43.7)
USER_IO_FPGA1_IO38: FPGA_1 (U9.U1), User IO Buffers (U43.8)
USER_IO_FPGA1_IO39: FPGA_1 (U9.U5), User IO Buffers (U43.9)
USER_IO_FPGA1_IO40: FPGA_1 (U9.T6), User IO Buffers (U45.2)
USER_IO_FPGA1_IO41: FPGA_1 (U9.T5), User IO Buffers (U45.3)
USER_IO_FPGA1_IO42: FPGA_1 (U9.R4), User IO Buffers (U45.4)
USER_IO_FPGA1_IO43: FPGA_1 (U9.T4), User IO Buffers (U45.5)
USER_IO_FPGA1_IO44: FPGA_1 (U9.T1), User IO Buffers (U45.6)
USER_IO_FPGA1_IO45: FPGA_1 (U9.R2), User IO Buffers (U45.7)
USER_IO_FPGA1_IO46: FPGA_1 (U9.R3), User IO Buffers (U45.8)
USER_IO_FPGA1_IO47: FPGA_1 (U9.R6), User IO Buffers (U45.9)
USER_IOB0_BUFFER_IO0: User IO (J7.80), User IO Buffers (U35.19)
USER_IOB0_BUFFER_IO1: User IO (J7.77), User IO Buffers (U35.18)
USER_IOB0_BUFFER_IO2: User IO (J7.76), User IO Buffers (U35.17)
USER_IOB0_BUFFER_IO3: User IO (J7.73), User IO Buffers (U35.16)
USER_IOB0_BUFFER_IO4: User IO (J7.72), User IO Buffers (U35.15)
USER_IOB0_BUFFER_IO5: User IO (J7.69), User IO Buffers (U35.14)
USER_IOB0_BUFFER_IO6: User IO (J7.68), User IO Buffers (U35.13)
USER_IOB0_BUFFER_IO7: User IO (J7.65), User IO Buffers (U35.12)
USER_IOB0_BUFFER_IO8: User IO (J7.64), User IO Buffers (U37.19)
USER_IOB0_BUFFER_IO9: User IO (J7.61), User IO Buffers (U37.18)
USER_IOB0_BUFFER_IO10: User IO (J7.60), User IO Buffers (U37.17)
USER_IOB0_BUFFER_IO11: User IO (J7.57), User IO Buffers (U37.16)
USER_IOB0_BUFFER_IO12: User IO (J7.56), User IO Buffers (U37.15)
USER_IOB0_BUFFER_IO13: User IO (J7.53), User IO Buffers (U37.14)
USER_IOB0_BUFFER_IO14: User IO (J7.52), User IO Buffers (U37.13)
USER_IOB0_BUFFER_IO15: User IO (J7.49), User IO Buffers (U37.12)
USER_IOB0_BUFFER_IO16: User IO (J7.48), User IO Buffers (U36.19)
USER_IOB0_BUFFER_IO17: User IO (J7.45), User IO Buffers (U36.18)
USER_IOB0_BUFFER_IO18: User IO (J7.44), User IO Buffers (U36.17)
USER_IOB0_BUFFER_IO19: User IO (J7.41), User IO Buffers (U36.16)
USER_IOB0_BUFFER_IO20: User IO (J7.40), User IO Buffers (U36.15)
USER_IOB0_BUFFER_IO21: User IO (J7.37), User IO Buffers (U36.14)
USER_IOB0_BUFFER_IO22: User IO (J7.36), User IO Buffers (U36.13)
USER_IOB0_BUFFER_IO23: User IO (J7.33), User IO Buffers (U36.12)
USER_IOB0_BUFFER_IO24: User IO (J7.32), User IO Buffers (U34.19)
USER_IOB0_BUFFER_IO25: User IO (J7.29), User IO Buffers (U34.18)
USER_IOB0_BUFFER_IO26: User IO (J7.28), User IO Buffers (U34.17)
USER_IOB0_BUFFER_IO27: User IO (J7.25), User IO Buffers (U34.16)
USER_IOB0_BUFFER_IO28: User IO (J7.24), User IO Buffers (U34.15)
USER_IOB0_BUFFER_IO29: User IO (J7.21), User IO Buffers (U34.14)
USER_IOB0_BUFFER_IO30: User IO (J7.20), User IO Buffers (U34.13)
USER_IOB0_BUFFER_IO31: User IO (J7.17), User IO Buffers (U34.12)
USER_IOB0_BUFFER_IO32: User IO (J7.16), User IO Buffers (U38.19)
USER_IOB0_BUFFER_IO33: User IO (J7.13), User IO Buffers (U38.18)
USER_IOB0_BUFFER_IO34: User IO (J7.12), User IO Buffers (U38.17)
USER_IOB0_BUFFER_IO35: User IO (J7.9), User IO Buffers (U38.16)
USER_IOB0_BUFFER_IO36: User IO (J8.9), User IO Buffers (U38.15)
USER_IOB0_BUFFER_IO37: User IO (J8.12), User IO Buffers (U38.14)
USER_IOB0_BUFFER_IO38: User IO (J8.13), User IO Buffers (U38.13)
USER_IOB0_BUFFER_IO39: User IO (J8.16), User IO Buffers (U38.12)
USER_IOB0_BUFFER_IO40: User IO (J8.17), User IO Buffers (U39.19)
USER_IOB0_BUFFER_IO41: User IO (J8.20), User IO Buffers (U39.18)
USER_IOB0_BUFFER_IO42: User IO (J8.21), User IO Buffers (U39.17)
USER_IOB0_BUFFER_IO43: User IO (J8.24), User IO Buffers (U39.16)
USER_IOB0_BUFFER_IO44: User IO (J8.25), User IO Buffers (U39.15)
USER_IOB0_BUFFER_IO45: User IO (J8.28), User IO Buffers (U39.14)
USER_IOB0_BUFFER_IO46: User IO (J8.29), User IO Buffers (U39.13)
USER_IOB0_BUFFER_IO47: User IO (J8.32), User IO Buffers (U39.12)
USER_IOB1_BUFFER_IO0: User IO (J8.57), User IO Buffers (U40.19)
USER_IOB1_BUFFER_IO1: User IO (J8.60), User IO Buffers (U40.18)
USER_IOB1_BUFFER_IO2: User IO (J8.61), User IO Buffers (U40.17)
USER_IOB1_BUFFER_IO3: User IO (J8.64), User IO Buffers (U40.16)
USER_IOB1_BUFFER_IO4: User IO (J8.65), User IO Buffers (U40.15)
USER_IOB1_BUFFER_IO5: User IO (J8.68), User IO Buffers (U40.14)
USER_IOB1_BUFFER_IO6: User IO (J8.69), User IO Buffers (U40.13)
USER_IOB1_BUFFER_IO7: User IO (J8.72), User IO Buffers (U40.12)
USER_IOB1_BUFFER_IO8: User IO (J8.73), User IO Buffers (U41.19)
USER_IOB1_BUFFER_IO9: User IO (J8.76), User IO Buffers (U41.18)
USER_IOB1_BUFFER_IO10: User IO (J8.77), User IO Buffers (U41.17)
USER_IOB1_BUFFER_IO11: User IO (J8.80), User IO Buffers (U41.16)
USER_IOB1_BUFFER_IO12: User IO (J9.9), User IO Buffers (U41.15)
USER_IOB1_BUFFER_IO13: User IO (J9.12), User IO Buffers (U41.14)
USER_IOB1_BUFFER_IO14: User IO (J9.13), User IO Buffers (U41.13)
USER_IOB1_BUFFER_IO15: User IO (J9.16), User IO Buffers (U41.12)
USER_IOB1_BUFFER_IO16: User IO (J9.17), User IO Buffers (U42.19)
USER_IOB1_BUFFER_IO17: User IO (J9.20), User IO Buffers (U42.18)
USER_IOB1_BUFFER_IO18: User IO (J9.21), User IO Buffers (U42.17)
USER_IOB1_BUFFER_IO19: User IO (J9.24), User IO Buffers (U42.16)
USER_IOB1_BUFFER_IO20: User IO (J9.25), User IO Buffers (U42.15)
USER_IOB1_BUFFER_IO21: User IO (J9.28), User IO Buffers (U42.14)
USER_IOB1_BUFFER_IO22: User IO (J9.29), User IO Buffers (U42.13)
USER_IOB1_BUFFER_IO23: User IO (J9.32), User IO Buffers (U42.12)
USER_IOB1_BUFFER_IO24: User IO (J9.33), User IO Buffers (U44.19)
USER_IOB1_BUFFER_IO25: User IO (J9.36), User IO Buffers (U44.18)
USER_IOB1_BUFFER_IO26: User IO (J9.37), User IO Buffers (U44.17)
USER_IOB1_BUFFER_IO27: User IO (J9.40), User IO Buffers (U44.16)
USER_IOB1_BUFFER_IO28: User IO (J9.41), User IO Buffers (U44.15)
USER_IOB1_BUFFER_IO29: User IO (J9.44), User IO Buffers (U44.14)
USER_IOB1_BUFFER_IO30: User IO (J9.45), User IO Buffers (U44.13)
USER_IOB1_BUFFER_IO31: User IO (J9.48), User IO Buffers (U44.12)
USER_IOB1_BUFFER_IO32: User IO (J9.49), User IO Buffers (U43.19)
USER_IOB1_BUFFER_IO33: User IO (J9.52), User IO Buffers (U43.18)
USER_IOB1_BUFFER_IO34: User IO (J9.53), User IO Buffers (U43.17)
USER_IOB1_BUFFER_IO35: User IO (J9.56), User IO Buffers (U43.16)
USER_IOB1_BUFFER_IO36: User IO (J9.57), User IO Buffers (U43.15)
USER_IOB1_BUFFER_IO37: User IO (J9.60), User IO Buffers (U43.14)
USER_IOB1_BUFFER_IO38: User IO (J9.61), User IO Buffers (U43.13)
USER_IOB1_BUFFER_IO39: User IO (J9.64), User IO Buffers (U43.12)
USER_IOB1_BUFFER_IO40: User IO (J9.65), User IO Buffers (U45.19)
USER_IOB1_BUFFER_IO41: User IO (J9.68), User IO Buffers (U45.18)
USER_IOB1_BUFFER_IO42: User IO (J9.69), User IO Buffers (U45.17)
USER_IOB1_BUFFER_IO43: User IO (J9.72), User IO Buffers (U45.16)
USER_IOB1_BUFFER_IO44: User IO (J9.73), User IO Buffers (U45.15)
USER_IOB1_BUFFER_IO45: User IO (J9.76), User IO Buffers (U45.14)
USER_IOB1_BUFFER_IO46: User IO (J9.77), User IO Buffers (U45.13)
USER_IOB1_BUFFER_IO47: User IO (J9.80), User IO Buffers (U45.12)
USER_PMOD0_FPGA0_LVIO0: FPGA_0 (U14.L5), User IO Buffers (U46.2)
USER_PMOD0_FPGA0_LVIO1: FPGA_0 (U14.K6), User IO Buffers (U46.3)
USER_PMOD0_FPGA0_LVIO2: FPGA_0 (U14.L4), User IO Buffers (U46.4)
USER_PMOD0_FPGA0_LVIO3: FPGA_0 (U14.M6), User IO Buffers (U46.5)
USER_PMOD0_FPGA0_LVIO4: FPGA_0 (U14.M5), User IO Buffers (U46.6)
USER_PMOD0_FPGA0_LVIO5: FPGA_0 (U14.N5), User IO Buffers (U46.7)
USER_PMOD0_FPGA0_LVIO6: FPGA_0 (U14.P6), User IO Buffers (U46.8)
USER_PMOD0_FPGA0_LVIO7: FPGA_0 (U14.M3), User IO Buffers (U46.9)
USER_PMOD1_FPGA0_LVIO0: FPGA_0 (U14.P4), User IO Buffers (U47.2)
USER_PMOD1_FPGA0_LVIO1: FPGA_0 (U14.P5), User IO Buffers (U47.3)
USER_PMOD1_FPGA0_LVIO2: FPGA_0 (U14.P2), User IO Buffers (U47.4)
USER_PMOD1_FPGA0_LVIO3: FPGA_0 (U14.R1), User IO Buffers (U47.5)
USER_PMOD1_FPGA0_LVIO4: FPGA_0 (U14.N3), User IO Buffers (U47.6)
USER_PMOD1_FPGA0_LVIO5: FPGA_0 (U14.P1), User IO Buffers (U47.7)
USER_PMOD1_FPGA0_LVIO6: FPGA_0 (U14.N2), User IO Buffers (U47.8)
USER_PMOD1_FPGA0_LVIO7: FPGA_0 (U14.N4), User IO Buffers (U47.9)
USER_PMOD2_FPGA0_LVIO0: FPGA_0 (U14.L3), User IO Buffers (U48.2)
USER_PMOD2_FPGA0_LVIO1: FPGA_0 (U14.M2), User IO Buffers (U48.3)
USER_PMOD2_FPGA0_LVIO2: FPGA_0 (U14.M1), User IO Buffers (U48.4)
USER_PMOD2_FPGA0_LVIO3: FPGA_0 (U14.K3), User IO Buffers (U48.5)
USER_PMOD2_FPGA0_LVIO4: FPGA_0 (U14.L1), User IO Buffers (U48.6)
USER_PMOD2_FPGA0_LVIO5: FPGA_0 (U14.K2), User IO Buffers (U48.7)
USER_PMOD2_FPGA0_LVIO6: FPGA_0 (U14.K1), User IO Buffers (U48.8)
USER_PMOD2_FPGA0_LVIO7: FPGA_0 (U14.K4), User IO Buffers (U48.9)
USER_PMOD3_FPGA0_LVIO0: FPGA_0 (U14.J2), User IO Buffers (U49.2)
USER_PMOD3_FPGA0_LVIO1: FPGA_0 (U14.J1), User IO Buffers (U49.3)
USER_PMOD3_FPGA0_LVIO2: FPGA_0 (U14.J4), User IO Buffers (U49.4)
USER_PMOD3_FPGA0_LVIO3: FPGA_0 (U14.H2), User IO Buffers (U49.5)
USER_PMOD3_FPGA0_LVIO4: FPGA_0 (U14.J5), User IO Buffers (U49.6)
USER_PMOD3_FPGA0_LVIO5: FPGA_0 (U14.G2), User IO Buffers (U49.7)
USER_PMOD3_FPGA0_LVIO6: FPGA_0 (U14.J6), User IO Buffers (U49.8)
USER_PMOD3_FPGA0_LVIO7: FPGA_0 (U14.H5), User IO Buffers (U49.9)